# EAGLE schematic main (EAGLE 9.1.3)

## Sheet 1 of 5
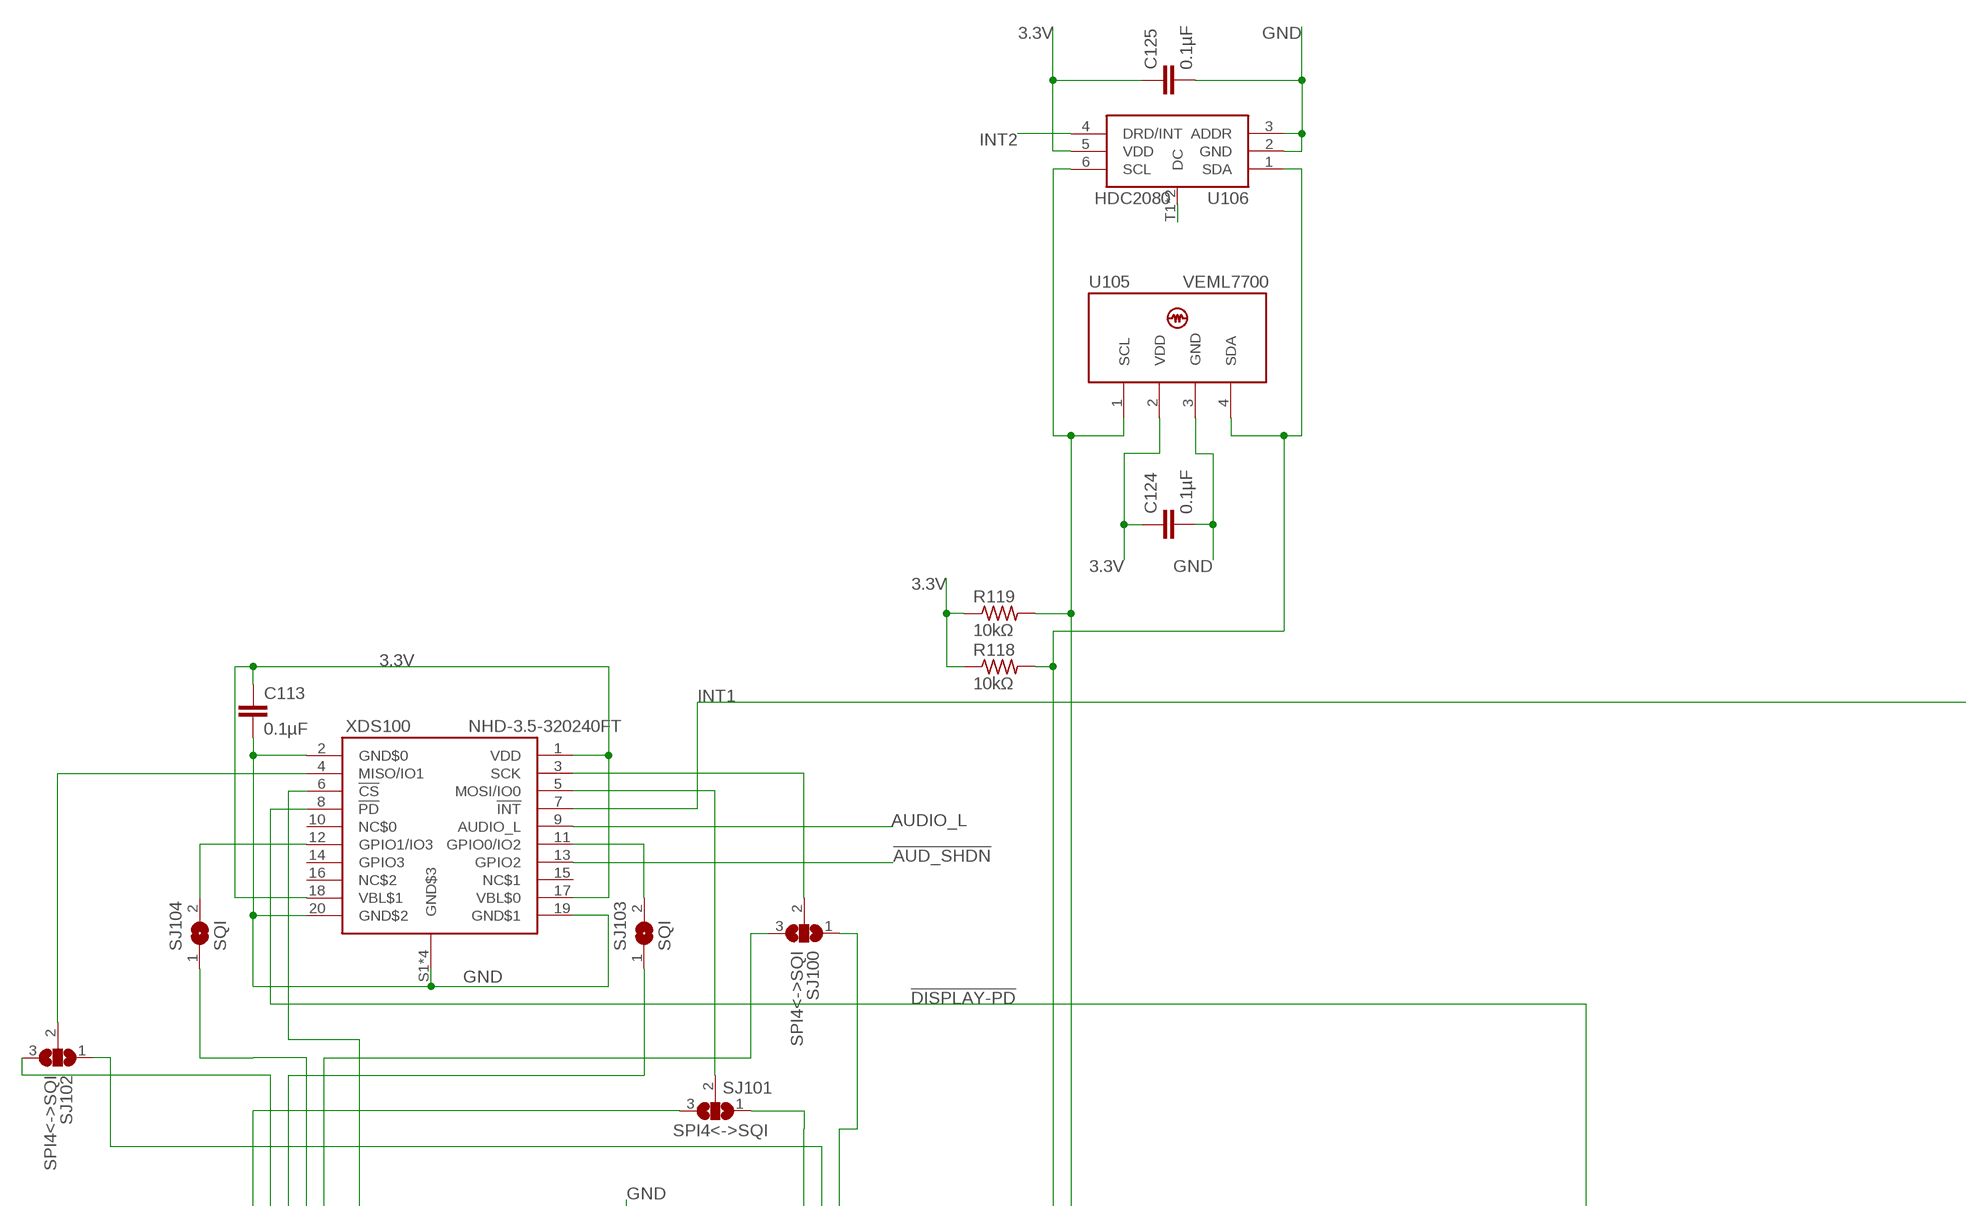
[diagram p0: schematic, sheet 1, part 1 of 3]
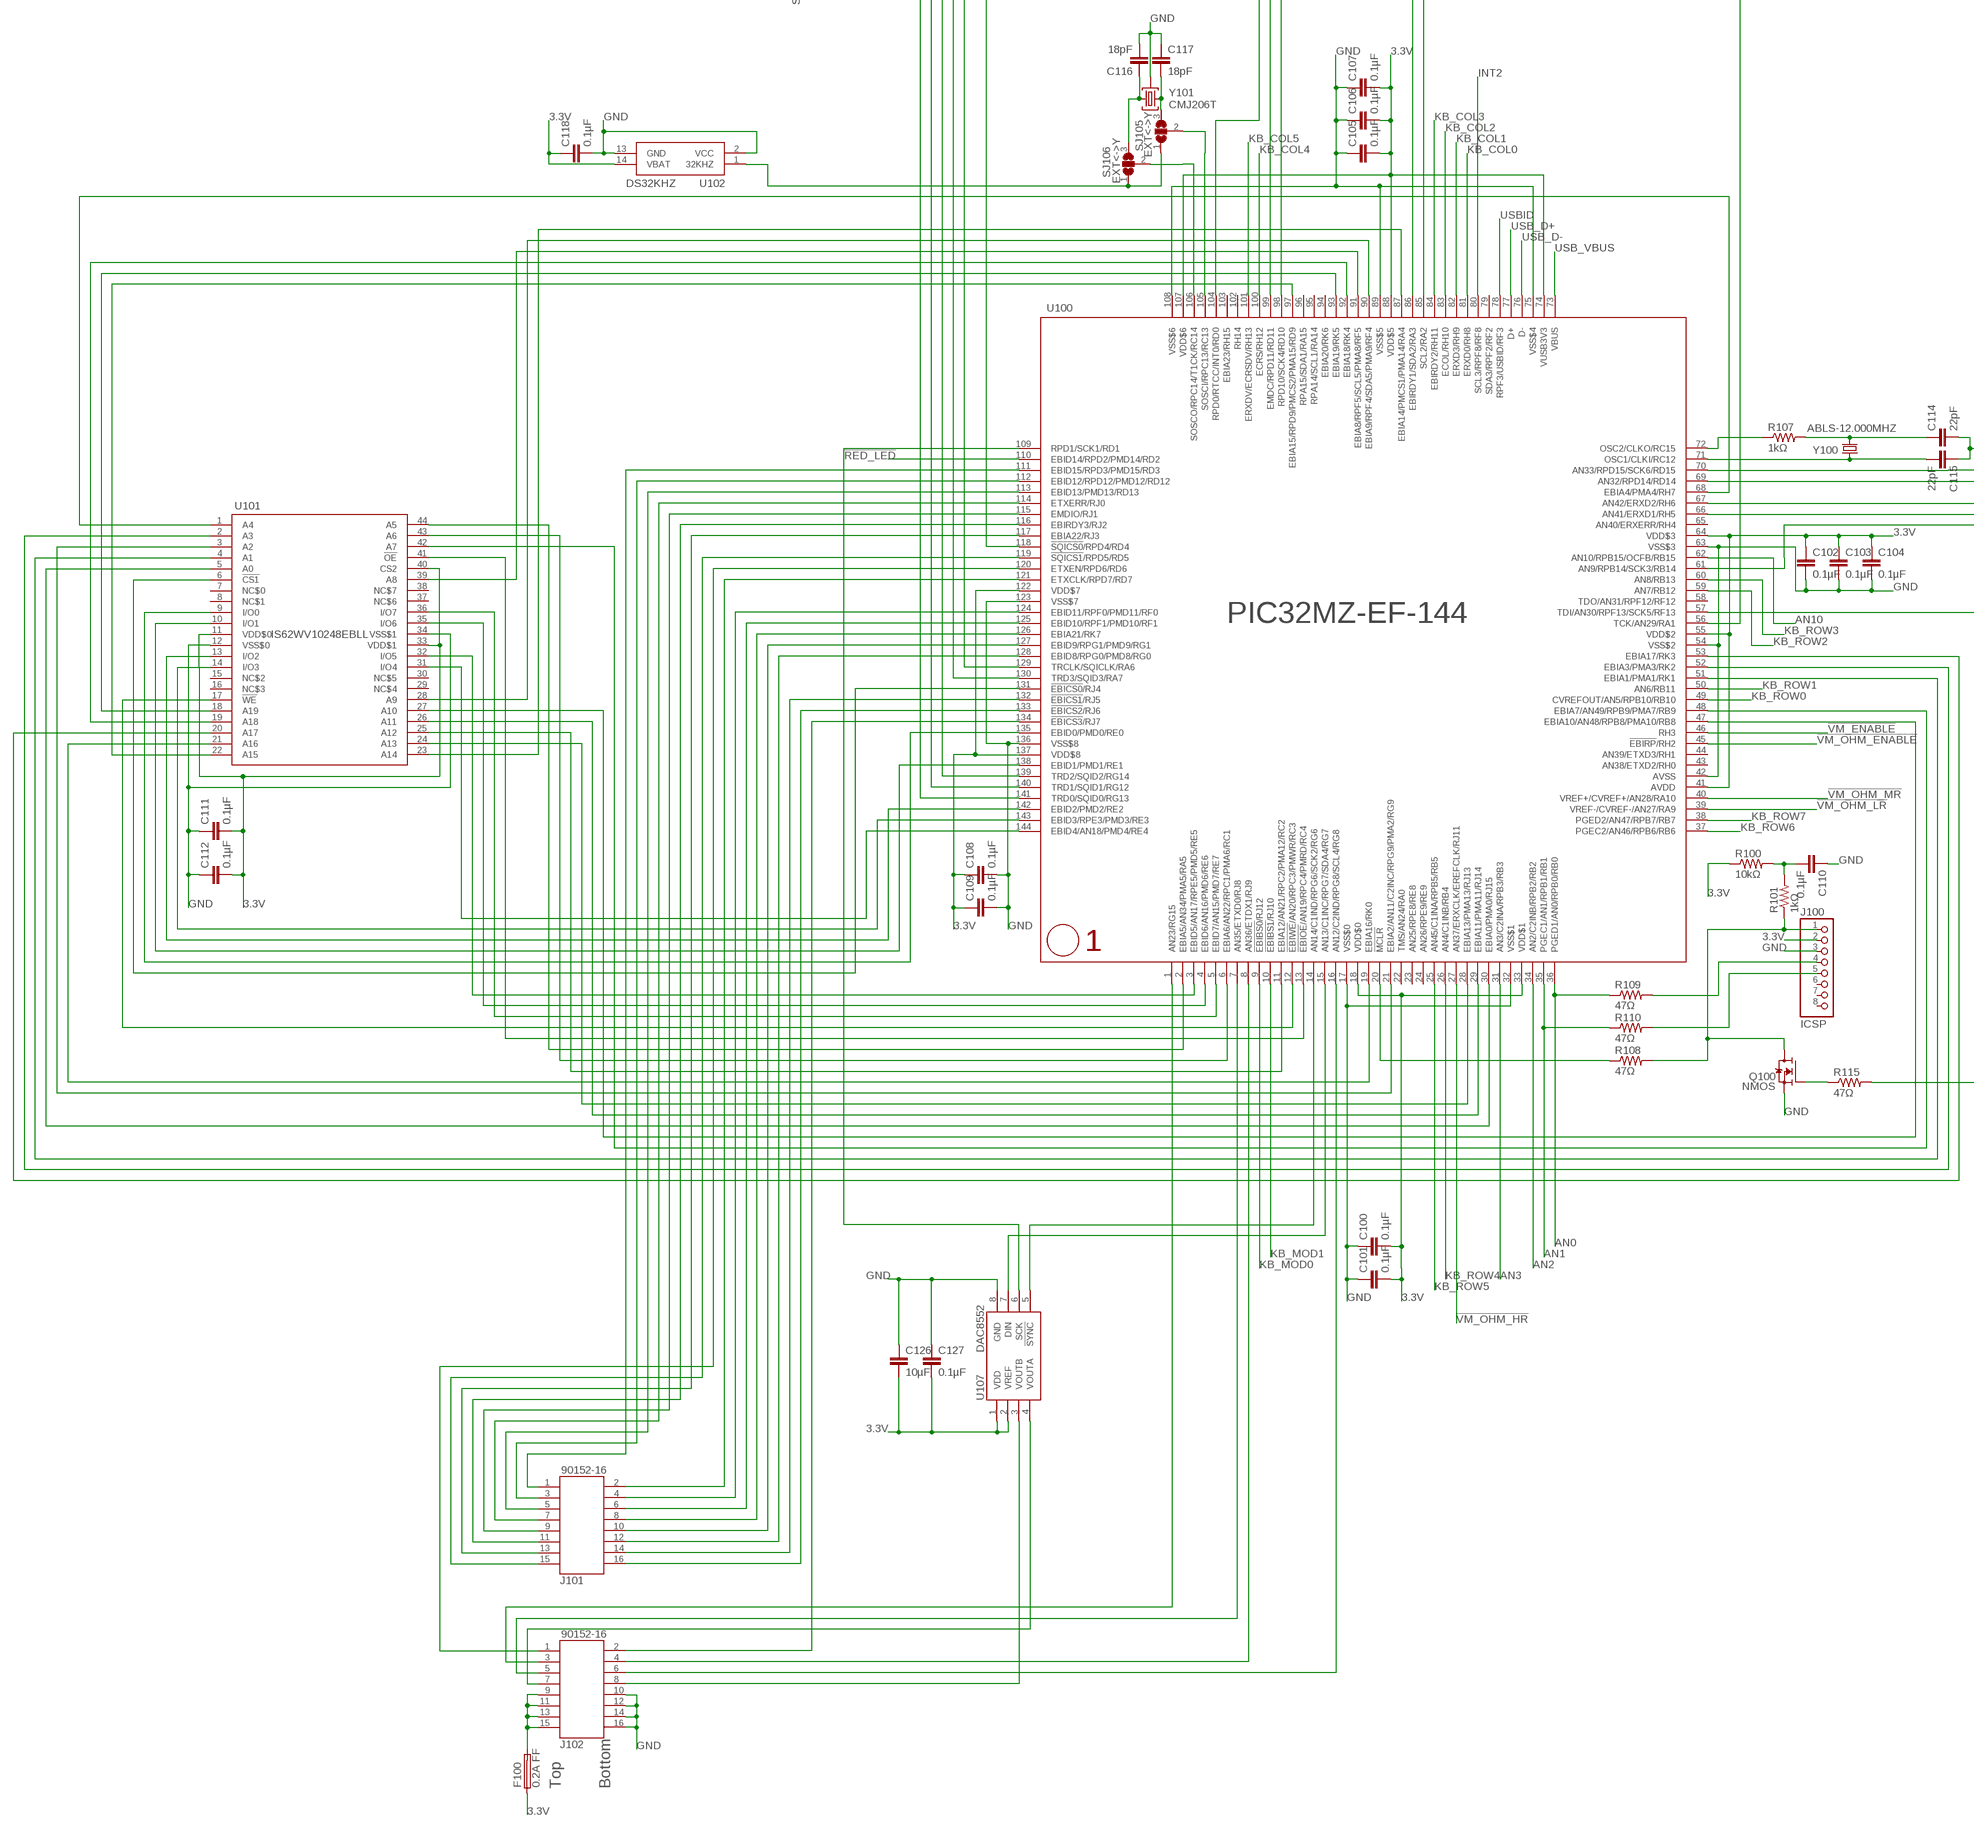
[diagram p1: schematic, sheet 1, part 2 of 3]
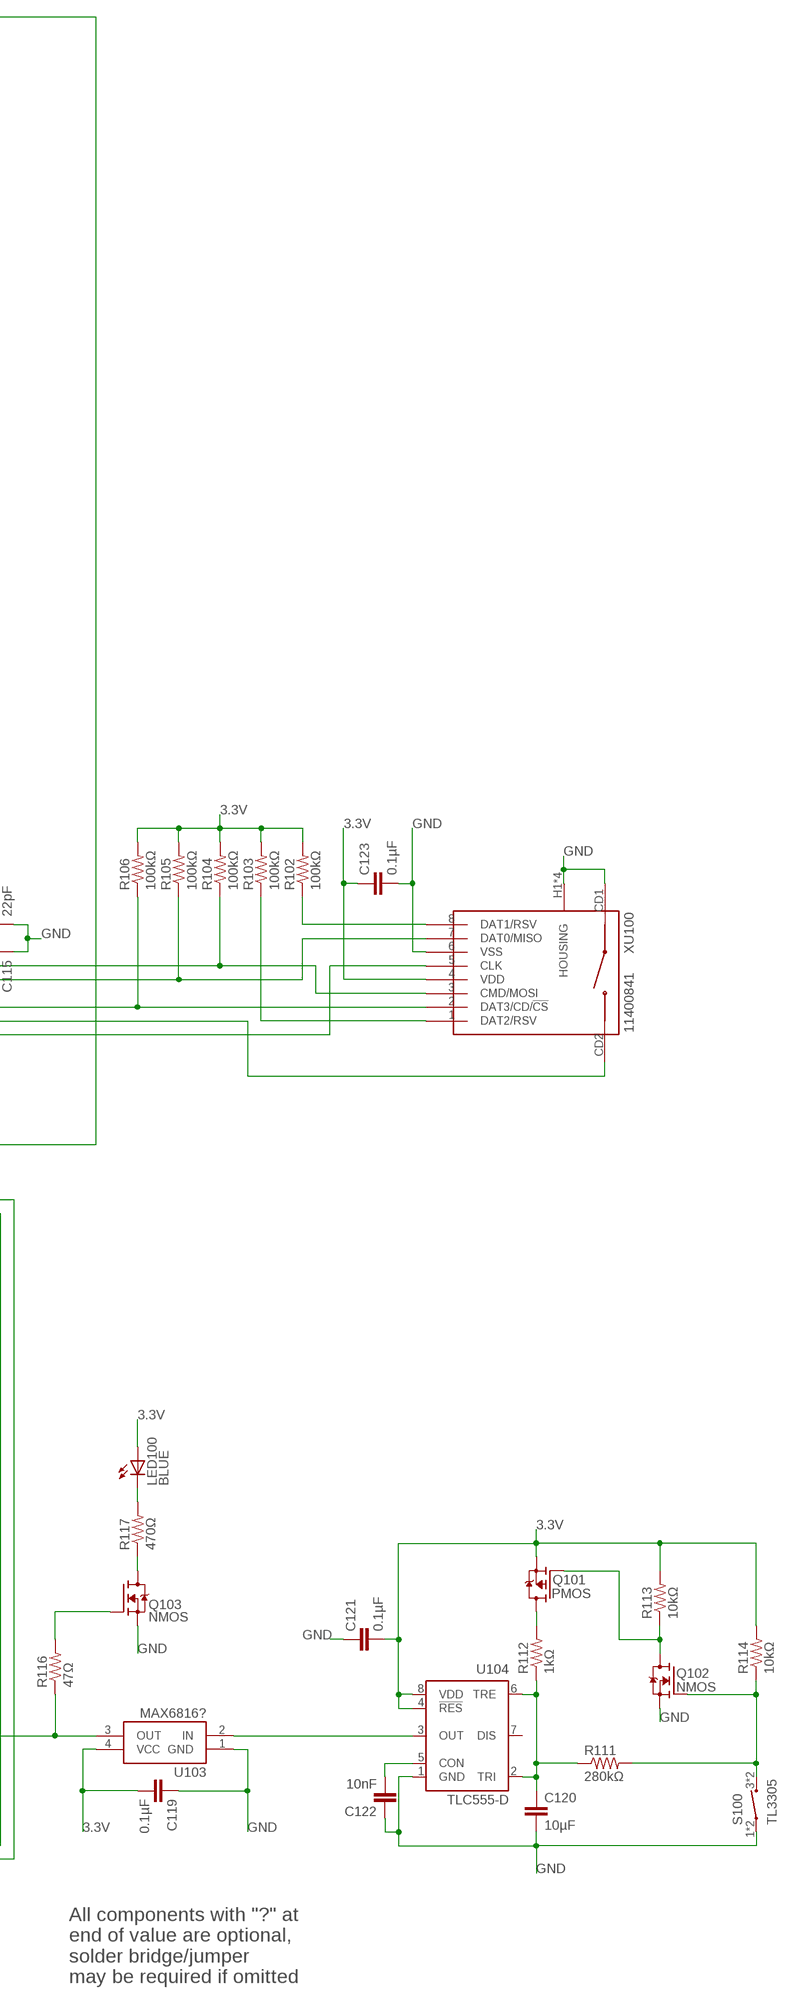
[diagram p2: schematic, sheet 1, part 3 of 3]

### Parts
C100  0.1µF  C-EUC0805K  [C0805K]
C101  0.1µF  C-EUC0805K  [C0805K]
C102  0.1µF  C-EUC0805K  [C0805K]
C103  0.1µF  C-EUC0805K  [C0805K]
C104  0.1µF  C-EUC0805K  [C0805K]
C105  0.1µF  C-EUC0805K  [C0805K]
C106  0.1µF  C-EUC0805K  [C0805K]
C107  0.1µF  C-EUC0805K  [C0805K]
C108  0.1µF  C-EUC0805K  [C0805K]
C109  0.1µF  C-EUC0805K  [C0805K]
C110  0.1µF  C-EUC0805K  [C0805K]
C111  0.1µF  C-EUC0805K  [C0805K]
C112  0.1µF  C-EUC0805K  [C0805K]
C113  0.1µF  C-EUC0805K  [C0805K]
C114  22pF  C-EUC0805K  [C0805K]
C115  22pF  C-EUC0805K  [C0805K]
C116  18pF  C-EUC0805K  [C0805K]
C117  18pF  C-EUC0805K  [C0805K]
C118  0.1µF  C-EUC0805K  [C0805K]
C119  0.1µF  C-EUC0805K  [C0805K]
C120  10µF  C-EUC0805K  [C0805K]
C121  0.1µF  C-EUC0805K  [C0805K]
C122  10nF  C-EUC0805K  [C0805K]
C123  0.1µF  C-EUC0805K  [C0805K]
C124  0.1µF  C-EUC0805K  [C0805K]
C125  0.1µF  C-EUC0805K  [C0805K]
C126  10µF  C-EUC0805K  [C0805K]
C127  0.1µF  C-EUC0805K  [C0805K]
F100  0.2A FF  1206-FUSE  [C1206K]
J100  ICSP  PINHD-1X8  [1X08]
J101  90152-16  [90152-16]
J102  90152-16  [90152-16]
LED100  BLUE  LEDCHIP-LED0805  [CHIP-LED0805]
Q100  NMOS  SOT23-N-MOSFET  [SOT23]
Q101  PMOS  SOT23-P-MOSFET  [SOT23]
Q102  NMOS  SOT23-N-MOSFET  [SOT23]
Q103  NMOS  SOT23-N-MOSFET  [SOT23]
R100  10kΩ  R-US_R0805  [R0805]
R101  1kΩ  R-US_R0805  [R0805]
R102  100kΩ  R-US_R0805  [R0805]
R103  100kΩ  R-US_R0805  [R0805]
R104  100kΩ  R-US_R0805  [R0805]
R105  100kΩ  R-US_R0805  [R0805]
R106  100kΩ  R-US_R0805  [R0805]
R107  1kΩ  R-US_R0805  [R0805]
R108  47Ω  R-US_R0805  [R0805]
R109  47Ω  R-US_R0805  [R0805]
R110  47Ω  R-US_R0805  [R0805]
R111  280kΩ  R-US_R0805  [R0805]
R112  1kΩ  R-US_R0805  [R0805]
R113  10kΩ  R-US_R0805  [R0805]
R114  10kΩ  R-US_R0805  [R0805]
R115  47Ω  R-US_R0805  [R0805]
R116  47Ω  R-US_R0805  [R0805]
R117  470Ω  R-US_R0805  [R0805]
R118  10kΩ  R-US_R0805  [R0805]
R119  10kΩ  R-US_R0805  [R0805]
S100  TL3305  [TL3305_MICROSWITCH]
SJ100  SPI4<->SQI  SJ2W  [SJ_2]
SJ101  SPI4<->SQI  SJ2W  [SJ_2]
SJ102  SPI4<->SQI  SJ2W  [SJ_2]
SJ103  SQI  SJ  [SJ]
SJ104  SQI  SJ  [SJ]
SJ105  EXT<->Y  SJ2W  [SJ_2]
SJ106  EXT<->Y  SJ2W  [SJ_2]
U100  PIC32MZ-EF-144  PIC32MZ-144  [LQFP144-20X20]
U101  IS62WV10248EBLL  [TSOP44]
U102  DS32KHZ  [SO16L]
U103  MAX6816?  MAX6816  [SOT143]
U104  TLC555-D  [SOIC8]
U105  VEML7700  [VEML7700]
U106  HDC2080  [PWSON-6]
U107  DAC8552  [MSOP8]
XDS100  NHD-3.5-320240FT  [NHD_DISPLAY_CONN]
XU100  11400841  [11400841]
Y100  ABLS-12.000MHZ  HC49US-CRYSTAL  [HC49US]
Y101  CMJ206T  [CMJ206T-CUSTOM]

### Nets
3.3V: C100.2 C101.2 C102.1 C103.1 C104.1 C105.2 C106.2 C107.2 C108.1 C109.1 C111.2 C112.2 C113.1 C118.1 C119.2 C121.2 C123.1 C124.1 C125.1 C126.2 C127.2 F100.1 J100.2 LED100.A Q101.2(S) R100.1 R102.2 R103.2 R104.2 R105.2 R106.2 R113.2 R114.2 R118.1 R119.1 U100.18(VDD$0) U100.33(VDD$1) U100.41(AVDD) U100.55(VDD$2) U100.64(VDD$3) U100.74(VUSB3V3) U100.88(VDD$5) U100.107(VDD$6) U100.122(VDD$7) U100.137(VDD$8) U101.11(VDD$0) U101.33(VDD$1) U101.40(CS2) U102.14(VBAT) U103.4(VCC) U104.4(!RES) U104.8(VDD) U105.2(VDD) U106.5(VDD) U107.1(VDD) U107.2(VREF) XDS100.1(VDD) XDS100.17(VBL$0) XDS100.18(VBL$1) XU100.4(VDD) ; also sheet 2,3,4,5
!AUD_SHDN: XDS100.13(GPIO2) ; also sheet 5
!DISPLAY-PD: U100.56(TCK/AN29/RA1) XDS100.8(!PD)
!EBICS0: U100.131(!EBICS0!/RJ4) U101.6(!CS1)
!EBIOE: U100.13(!EBIOE!/AN19/RPC4/PMRD/RC4) U101.41(!OE)
!EBIWE: U100.12(!EBIWE!/AN20/RPC3/PMWR/RC3) U101.17(!WE)
!MCLR: R108.1 U100.20(!MCLR)
!MCLR!_FILTER: C110.2 R100.2 R101.2
!MCLR!_R: J100.1 Q100.3(D) R101.1 R108.2
!RED_LED: U100.110(EBID14/RPD2/PMD14/RD2) ; also sheet 2
!RESET_MAN!_RAW: Q102.1(G) R111.2 R114.1 S100.3 S100.4
!SQICS0: U100.118(!SQICS0!/RPD4/RD4) XDS100.6(!CS)
!VM_ENABLE: U100.46(RH3) ; also sheet 4
!VM_OHM_ENABLE: U100.45(!EBIRP!/RH2) ; also sheet 4
!VM_OHM_HR: U100.27(AN37/ERXCLK/EREFCLK/RJ11) ; also sheet 4
!VM_OHM_LR: U100.39(VREF-/CVREF-/AN27/RA9) ; also sheet 4
!VM_OHM_MR: U100.40(VREF+/CVREF+/AN28/RA10) ; also sheet 4
AN0: R109.1 U100.36(PGED1/AN0/RPB0/RB0) ; also sheet 4
AN1: R110.1 U100.35(PGEC1/AN1/RPB1/RB1) ; also sheet 4
AN2: U100.34(AN2/C2INB/RPB2/RB2) ; also sheet 4
AN3: U100.31(AN3/C2INA/RPB3/RB3) ; also sheet 4
AN10: U100.62(AN10/RPB15/OCFB/RB15) ; also sheet 2
AN12/A3: J102.6 U100.16(AN12/C2IND/RPG8/SCL4/RG8)
AN23/A0: J102.3 U100.1(AN23/RG15)
AN35/A1: J102.5 U100.7(AN35/ETXD0/RJ8)
AN36/A2: J102.4 U100.8(AN36/ETDX1/RJ9)
AUDIO_L: XDS100.9(AUDIO_L) ; also sheet 5
DAC_OUT_A: J102.7 U107.4(VOUTA)
DAC_OUT_B: J102.8 U107.3(VOUTB)
DISP_IO0: SJ101.2 XDS100.5(MOSI/IO0)
DISP_IO1: SJ102.2 XDS100.4(MISO/IO1)
DISP_IO2: SJ103.2 XDS100.11(GPIO0/IO2)
DISP_IO3: SJ104.2 XDS100.12(GPIO1/IO3)
DISP_SCK: SJ100.2 XDS100.3(SCK)
EBIA0: U100.30(EBIA0/PMA0/RJ15) U101.5(A0)
EBIA1: U100.51(EBIA1/PMA1/RK1) U101.4(A1)
EBIA2: U100.21(EBIA2/AN11/C2INC/RPG9/PMA2/RG9) U101.3(A2)
EBIA3: U100.52(EBIA3/PMA3/RK2) U101.2(A3)
EBIA4: U100.68(EBIA4/PMA4/RH7) U101.1(A4)
EBIA5: U100.2(EBIA5/AN34/PMA5/RA5) U101.44(A5)
EBIA6: U100.6(EBIA6/AN22/RPC1/PMA6/RC1) U101.43(A6)
EBIA7: U100.48(EBIA7/AN49/RPB9/PMA7/RB9) U101.42(A7)
EBIA8: U100.91(EBIA8/RPF5/SCL5/PMA8/RF5) U101.39(A8)
EBIA9: U100.90(EBIA9/RPF4/SDA5/PMA9/RF4) U101.28(A9)
EBIA10: U100.47(EBIA10/AN48/RPB8/PMA10/RB8) U101.27(A10)
EBIA11: U100.29(EBIA11/PMA11/RJ14) U101.26(A11)
EBIA12: U100.11(EBIA12/AN21/RPC2/PMA12/RC2) U101.25(A12)
EBIA13: U100.28(EBIA13/PMA13/RJ13) U101.24(A13)
EBIA14: U100.87(EBIA14/PMCS1/PMA14/RA4) U101.23(A14)
EBIA15: U100.97(EBIA15/RPD9/PMCS2/PMA15/RD9) U101.22(A15)
EBIA16: U100.19(EBIA16/RK0) U101.21(A16)
EBIA17: U100.53(EBIA17/RK3) U101.20(A17)
EBIA18: U100.92(EBIA18/RK4) U101.19(A18)
EBIA19: U100.93(EBIA19/RK5) U101.18(A19)
EBID0: U100.135(EBID0/PMD0/RE0) U101.9(I/O0)
EBID1: U100.138(EBID1/PMD1/RE1) U101.10(I/O1)
EBID2: U100.142(EBID2/PMD2/RE2) U101.13(I/O2)
EBID3: U100.143(EBID3/RPE3/PMD3/RE3) U101.14(I/O3)
EBID4: U100.144(EBID4/AN18/PMD4/RE4) U101.31(I/O4)
EBID5: U100.3(EBID5/AN17/RPE5/PMD5/RE5) U101.32(I/O5)
EBID6: U100.4(EBID6/AN16/PMD6/RE6) U101.35(I/O6)
EBID7: U100.5(EBID7/AN15/PMD7/RE7) U101.36(I/O7)
GND: C100.1 C101.1 C102.2 C103.2 C104.2 C105.1 C106.1 C107.1 C108.2 C109.2 C110.1 C111.1 C112.1 C113.2 C114.2 C115.1 C116.2 C117.1 C118.2 C119.1 C120.2 C121.1 C122.1 C123.2 C124.2 C125.2 C126.1 C127.1 J100.3 J102.10 J102.12 J102.14 J102.16 Q100.2(S) Q102.2(S) Q103.2(S) S100.1 S100.2 U100.17(VSS$0) U100.32(VSS$1) U100.42(AVSS) U100.54(VSS$2) U100.63(VSS$3) U100.75(VSS$4) U100.89(VSS$5) U100.108(VSS$6) U100.123(VSS$7) U100.136(VSS$8) U101.12(VSS$0) U101.34(VSS$1) U102.2(VCC) U102.13(GND) U103.1(GND) U104.1(GND) U105.3(GND) U106.2(GND) U106.3(ADDR) U107.8(GND) XDS100.2(GND$0) XDS100.19(GND$1) XDS100.20(GND$2) XDS100.S1(GND$3) XDS100.S2(GND$3) XDS100.S3(GND$3) XDS100.S4(GND$3) XU100.6(VSS) XU100.CD1 XU100.H1(HOUSING) XU100.H2(HOUSING) XU100.H3(HOUSING) XU100.H4(HOUSING) Y101.GND ; also sheet 2,4,5
INT1: U100.57(TDI/AN30/RPF13/SCK5/RF13) XDS100.7(!INT)
INT2: U100.80(SCL3/RPF8/RF8) U106.4(DRD/INT)
KB_COL0: U100.81(ERXD0/RH8) ; also sheet 3
KB_COL1: U100.82(ERXD3/RH9) ; also sheet 3
KB_COL2: U100.83(ECOL/RH10) ; also sheet 3
KB_COL3: U100.84(EBIRDY2/RH11) ; also sheet 3
KB_COL4: U100.100(ECRS/RH12) ; also sheet 3
KB_COL5: U100.101(ERXDV/ECRSDV/RH13) ; also sheet 3
KB_MOD0: U100.9(!EBIBS0!/RJ12) ; also sheet 3
KB_MOD1: U100.10(!EBIBS1!/RJ10) ; also sheet 3
KB_ROW0: U100.49(CVREFOUT/AN5/RPB10/RB10) ; also sheet 3
KB_ROW1: U100.50(AN6/RB11) ; also sheet 3
KB_ROW2: U100.59(AN7/RB12) ; also sheet 3
KB_ROW3: U100.60(AN8/RB13) ; also sheet 3
KB_ROW4: U100.26(AN4/C1INB/RB4) ; also sheet 3
KB_ROW5: U100.25(AN45/C1INA/RPB5/RB5) ; also sheet 3
KB_ROW6: U100.37(PGEC2/AN46/RPB6/RB6) ; also sheet 3
KB_ROW7: U100.38(PGED2/AN47/RPB7/RB7) ; also sheet 3
LED100_K: LED100.C R117.2
LED100_SWITCHED: Q103.3(D) R117.1
OSC1: C115.2 U100.71(OSC1/CLKI/RC12) Y100.1
OSC2: R107.1 U100.72(OSC2/CLKO/RC15)
OSC2_R: C114.1 R107.2 Y100.2
OUT_3.3V: F100.2 J102.9 J102.11 J102.13 J102.15
PGEC_R: J100.5 R110.2
PGED_R: J100.4 R109.2
RD3/D0: J101.1 U100.111(EBID15/RPD3/PMD15/RD3)
RD5/D7: J101.15 U100.119(!SQICS1!/RPD5/RD5)
RD6/D8: J102.1 U100.120(ETXEN/RPD6/RD6)
RD7/D9: J101.2 U100.121(ETXCLK/RPD7/RD7)
RD12/D1: J101.3 U100.112(EBID12/RPD12/PMD12/RD12)
RD13/D2: J101.5 U100.113(EBID13/PMD13/RD13)
RESET_MAN_CAP: C120.1 R111.1 R112.1 U104.2(TRI) U104.6(TRE)
RESET_MAN_CHG: Q101.3(D) R112.2
RESET_MAN_CON: C122.2 U104.5(CON)
RESET_MAN_FINAL: R115.2 R116.1 U103.3(OUT)
RESET_MAN_GATE: Q100.1(G) R115.1
RESET_MAN_LED_GATE: Q103.1(G) R116.2
RESET_MAN_RAW: Q101.1(G) Q102.3(D) R113.1
RESET_MAN_TIMED: U103.2(IN) U104.3(OUT)
RF0/D10: J101.4 U100.124(EBID11/RPF0/PMD11/RF0)
RF1/D11: J101.6 U100.125(EBID10/RPF1/PMD10/RF1)
RG0/D14: J101.12 U100.128(EBID8/RPG0/PMD8/RG0)
RG1/D13: J101.10 U100.127(EBID9/RPG1/PMD9/RG1)
RJ0/D3: J101.7 U100.114(ETXERR/RJ0)
RJ1/D4: J101.9 U100.115(EMDIO/RJ1)
RJ2/D5: J101.11 U100.116(EBIRDY3/RJ2)
RJ3/D6: J101.13 U100.117(EBIA22/RJ3)
RJ5/D15: J101.14 U100.132(!EBICS1!/RJ5)
RJ6/D16: J101.16 U100.133(!EBICS2!/RJ6)
RJ7/D17: J102.2 U100.134(!EBICS3!/RJ7)
RK7/D12: J101.8 U100.126(EBIA21/RK7)
SCK1: U100.109(RPD1/SCK1/RD1) U107.6(SCK)
SCK3: U100.61(AN9/RPB14/SCK3/RB14) XU100.5(CLK)
SCK4: SJ100.1 U100.98(RPD10/SCK4/RD10)
SCL2: R119.2 U100.85(SCL2/RA2) U105.1(SCL) U106.6(SCL)
SD_CS: R106.1 U100.67(AN42/ERXD2/RH6) XU100.2(DAT3/CD/!CS)
SD_DETECT: U100.66(AN41/ERXD1/RH5) XU100.CD2
SD_RSV1: R102.1 XU100.8(DAT1/RSV)
SD_RSV2: R103.1 XU100.1(DAT2/RSV)
SDA2: R118.2 U100.86(EBIRDY1/SDA2/RA3) U105.4(SDA) U106.1(SDA)
SDI3: R105.1 U100.69(AN32/RPD14/RD14) XU100.7(DAT0/MISO)
SDI4: SJ102.1 U100.99(EMDC/RPD11/RD11)
SDO1: U100.15(AN13/C1INC/RPG7/SDA4/RG7) U107.7(DIN)
SDO3: R104.1 U100.70(AN33/RPD15/SCK6/RD15) XU100.3(CMD/MOSI)
SDO4: SJ101.1 U100.104(RPD0/RTCC/INT0/RD0)
SOSC_1: C117.2 SJ105.3 Y101.2
SOSC_2: C116.1 SJ106.3 Y101.1
SOSC_EXT: SJ105.1 SJ106.1 U102.1(32KHZ)
SOSCI: SJ105.2 U100.105(SOSCI/RPC13/RC13)
SOSCO: SJ106.2 U100.106(SOSCO/RPC14/T1CK/RC14)
SQICLK: SJ100.3 U100.129(TRCLK/SQICLK/RA6)
SQID0: SJ101.3 U100.141(TRD0/SQID0/RG13)
SQID1: SJ102.3 U100.140(TRD1/SQID1/RG12)
SQID2: SJ103.1 U100.139(TRD2/SQID2/RG14)
SQID3: SJ104.1 U100.130(TRD3/SQID3/RA7)
SS1: U100.14(AN14/C1IND/RPG6/SCK2/RG6) U107.5(!SYNC)
U106_TP: U106.T1(DC) U106.T2(DC)
USB_D+ [usb_diffpair]: U100.77(D+) ; also sheet 2
USB_D- [usb_diffpair]: U100.76(D-) ; also sheet 2
USB_VBUS: U100.73(VBUS) ; also sheet 2
USBID: U100.78(RPF3/USBID/RF3) ; also sheet 2
Unconnected: J100.6 J100.7 J100.8 U100.22(TMS/AN24/RA0) U100.23(AN25/RPE8/RE8) U100.24(AN26/RPE9/RE9) U100.43(AN38/ETXD2/RH0) U100.44(AN39/ETXD3/RH1) U100.58(TDO/AN31/RPF12/RF12) U100.65(AN40/ERXERR/RH4) U100.79(SDA3/RPF2/RF2) U100.94(EBIA20/RK6) U100.95(RPA14/SCL1/RA14) U100.96(RPA15/SDA1/RA15) U100.102(RH14) U100.103(EBIA23/RH15) U101.7(NC$0) U101.8(NC$1) U101.15(NC$2) U101.16(NC$3) U101.29(NC$4) U101.30(NC$5) U101.37(NC$6) U101.38(NC$7) U104.7(DIS) XDS100.10(NC$0) XDS100.14(GPIO3) XDS100.15(NC$1) XDS100.16(NC$2)

### Notes on the sheet
- All components with "?" at
  end of value are optional,
  solder bridge/jumper
  may be required if omitted
- Top
  
  
  Bottom

## Sheet 2 of 5
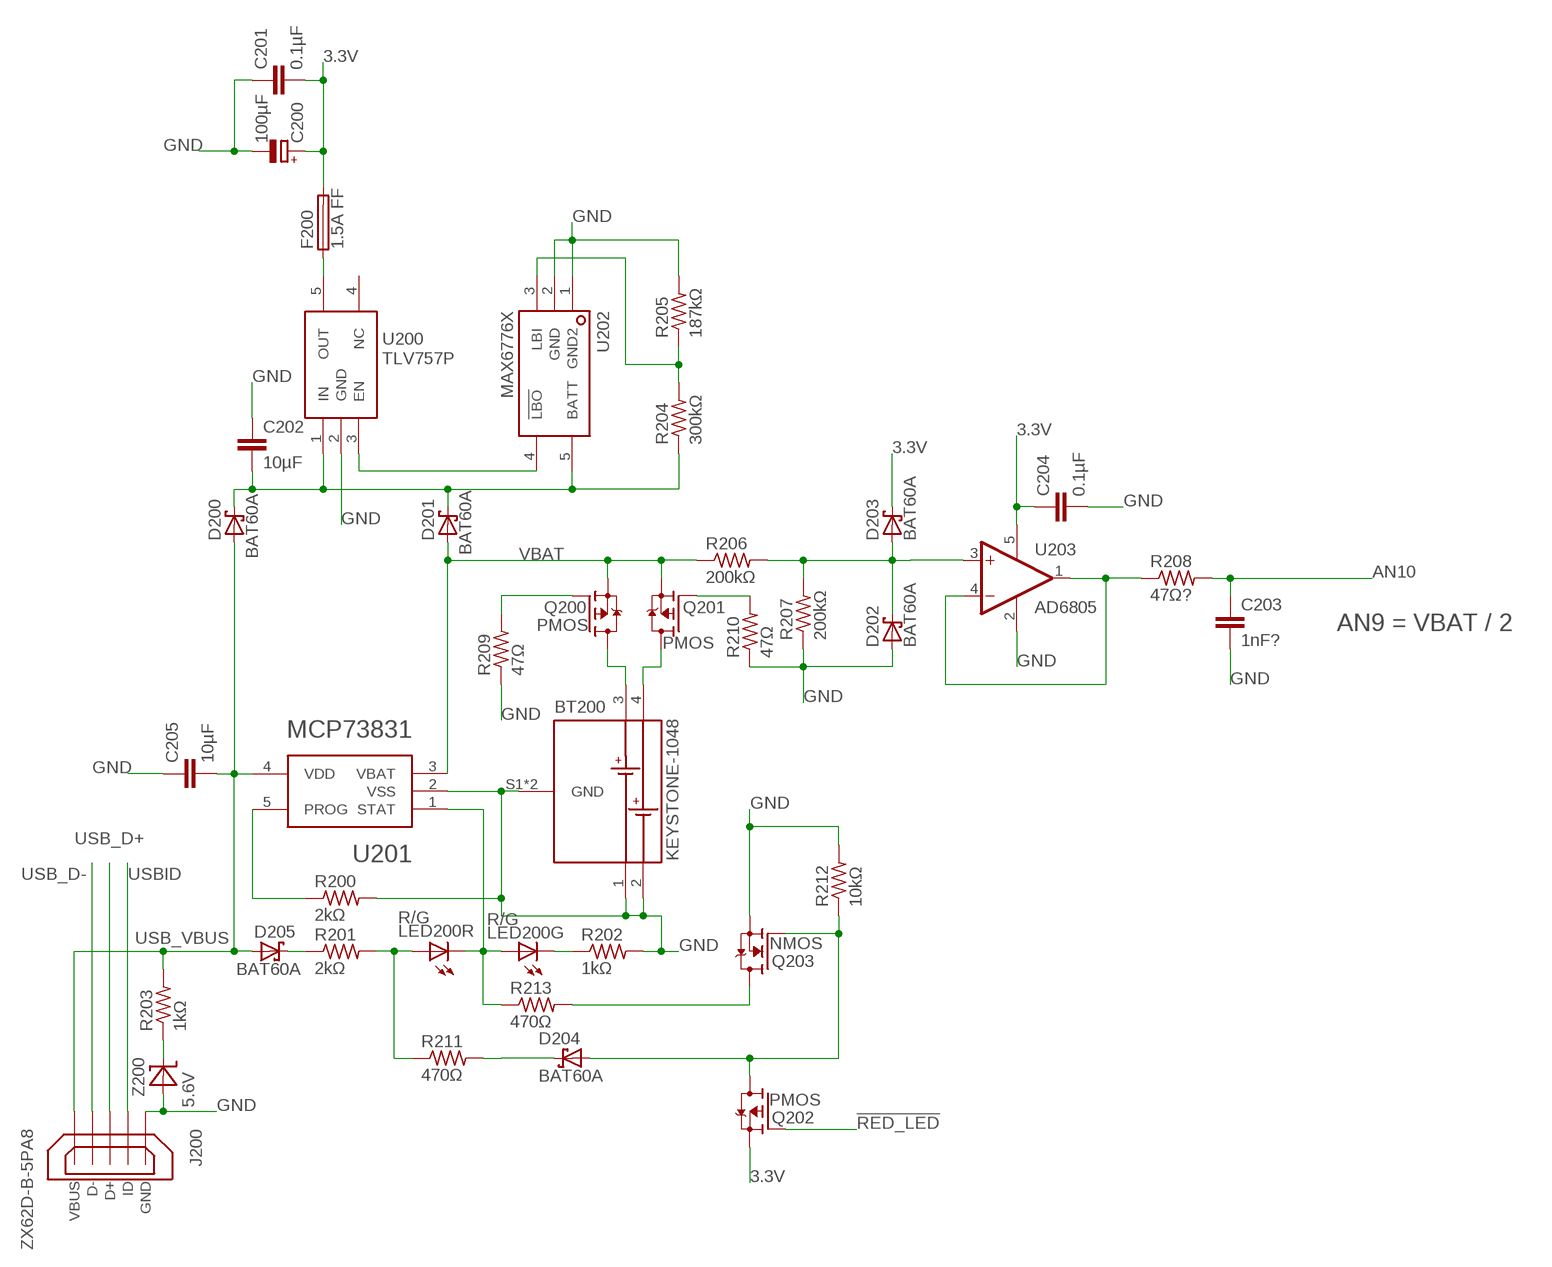
[diagram p3: schematic, sheet 2]

### Parts
BT200  KEYSTONE-1048  [KEYSTONE-1048]
C200  100µF  CPOL_1206  [C1206K-POL]
C201  0.1µF  C-EUC0805K  [C0805K]
C202  10µF  C-EUC0805K  [C0805K]
C203  1nF?  C-EUC0805K  [C0805K]
C204  0.1µF  C-EUC0805K  [C0805K]
C205  10µF  C-EUC0805K  [C0805K]
D200  BAT60A  SOD323-SCHOTTKY  [SOD323]
D201  BAT60A  SOD323-SCHOTTKY  [SOD323]
D202  BAT60A  SOD323-SCHOTTKY  [SOD323]
D203  BAT60A  SOD323-SCHOTTKY  [SOD323]
D204  BAT60A  SOD323-SCHOTTKY  [SOD323]
D205  BAT60A  SOD323-SCHOTTKY  [SOD323]
F200  1.5A FF  0805-FUSE  [C0805K]
J200  ZX62D-B-5PA8  [ZX62D-B-5PA8]
LED200  R/G  APHBM2012LSURKZGKC  [0805-DUALLED]
Q200  PMOS  SOT23-P-MOSFET  [SOT23]
Q201  PMOS  SOT23-P-MOSFET  [SOT23]
Q202  PMOS  SOT23-P-MOSFET  [SOT23]
Q203  NMOS  SOT23-N-MOSFET  [SOT23]
R200  2kΩ  R-US_R0805  [R0805]
R201  2kΩ  R-US_R0805  [R0805]
R202  1kΩ  R-US_R0805  [R0805]
R203  1kΩ  R-US_R0805  [R0805]
R204  300kΩ  R-US_R0805  [R0805]
R205  187kΩ  R-US_R0805  [R0805]
R206  200kΩ  R-US_R0805  [R0805]
R207  200kΩ  R-US_R0805  [R0805]
R208  47Ω?  R-US_R0805  [R0805]
R209  47Ω  R-US_R0805  [R0805]
R210  47Ω  R-US_R0805  [R0805]
R211  470Ω  R-US_R0805  [R0805]
R212  10kΩ  R-US_R0805  [R0805]
R213  470Ω  R-US_R0805  [R0805]
U200  TLV757P  [SOT23-5L]
U201  MCP73831  [SOT23-5L]
U202  MAX6776X  [SC70-5]
U203  AD6805  [SOT23-5L]
Z200  5.6V  SOD323HE-ZENER  [SOD323HE]

### Nets
3.3V: C200.1(+) C201.2 C204.1 D203.1(C) F200.2 Q202.2(S) U203.5(V+) ; also sheet 1,3,4,5
!RED_LED: Q202.1(G) ; also sheet 1
AN10: C203.1 R208.2 ; also sheet 1
BAT1_PMOS_GATE: Q200.1(G) R209.2
BAT2_PMOS_GATE: Q201.1(G) R210.2
BATM_LBI: R204.2 R205.1 U202.3(LBI)
CHG_PROG: R200.1 U201.5(PROG)
CHG_STAT: LED200.A2(G:A) LED200.K1(R:C) R213.1 U201.1(STAT)
GND: BT200.1(BAT1-) BT200.2(BAT2-) BT200.S1(GND) BT200.S2(GND) C200.2(-) C201.1 C202.1 C203.2 C204.2 C205.1 D202.2(A) J200.5(GND) J200.S1(GND) J200.S2(GND) J200.S3(GND) J200.S4(GND) Q203.2(S) R200.2 R202.2 R205.2 R207.1 R209.1 R210.1 R212.2 U200.2(GND) U201.2(VSS) U202.1(GND2) U202.2(GND) U203.2(V-) Z200.2(A) ; also sheet 1,4,5
LED200_GK: LED200.K2(G:C) R202.1
LED200_RA: LED200.A1(R:A) R201.2 R211.1
LED200_RA_EXT: D204.1(C) R211.2
LED200_RA_INT: D205.1(C) R201.1
LED200_RK_EXT: Q203.3(D) R213.2
RED_LED: D204.2(A) Q202.3(D) Q203.1(G) R212.1
USB_D+ [usb_diffpair]: J200.3(D+) ; also sheet 1
USB_D- [usb_diffpair]: J200.2(D-) ; also sheet 1
USB_VBUS: C205.2 D200.2(A) D205.2(A) J200.1(VBUS) R203.2 U201.4(VDD) ; also sheet 1
USBID: J200.4(ID) ; also sheet 1
VBAT: D201.2(A) Q200.2(S) Q201.2(S) R206.1 U201.3(VBAT)
VBAT1: BT200.3(BAT1+) Q200.3(D)
VBAT2: BT200.4(BAT2+) Q201.3(D)
VBAT_SENSE: D202.1(C) D203.2(A) R206.2 R207.2 U203.3(+IN)
VBAT_SENSE_BUF: R208.1 U203.1(OUT) U203.4(-IN)
VREG_EN: U200.3(EN) U202.4(!LBO)
VREG_IN: C202.2 D200.1(C) D201.1(C) R204.1 U200.1(IN) U202.5(BATT)
VREG_OUT: F200.1 U200.5(OUT)
Z200_K: R203.1 Z200.1(C)
Unconnected: U200.4(NC)

### Notes on the sheet
- AN9 = VBAT / 2

## Sheet 3 of 5
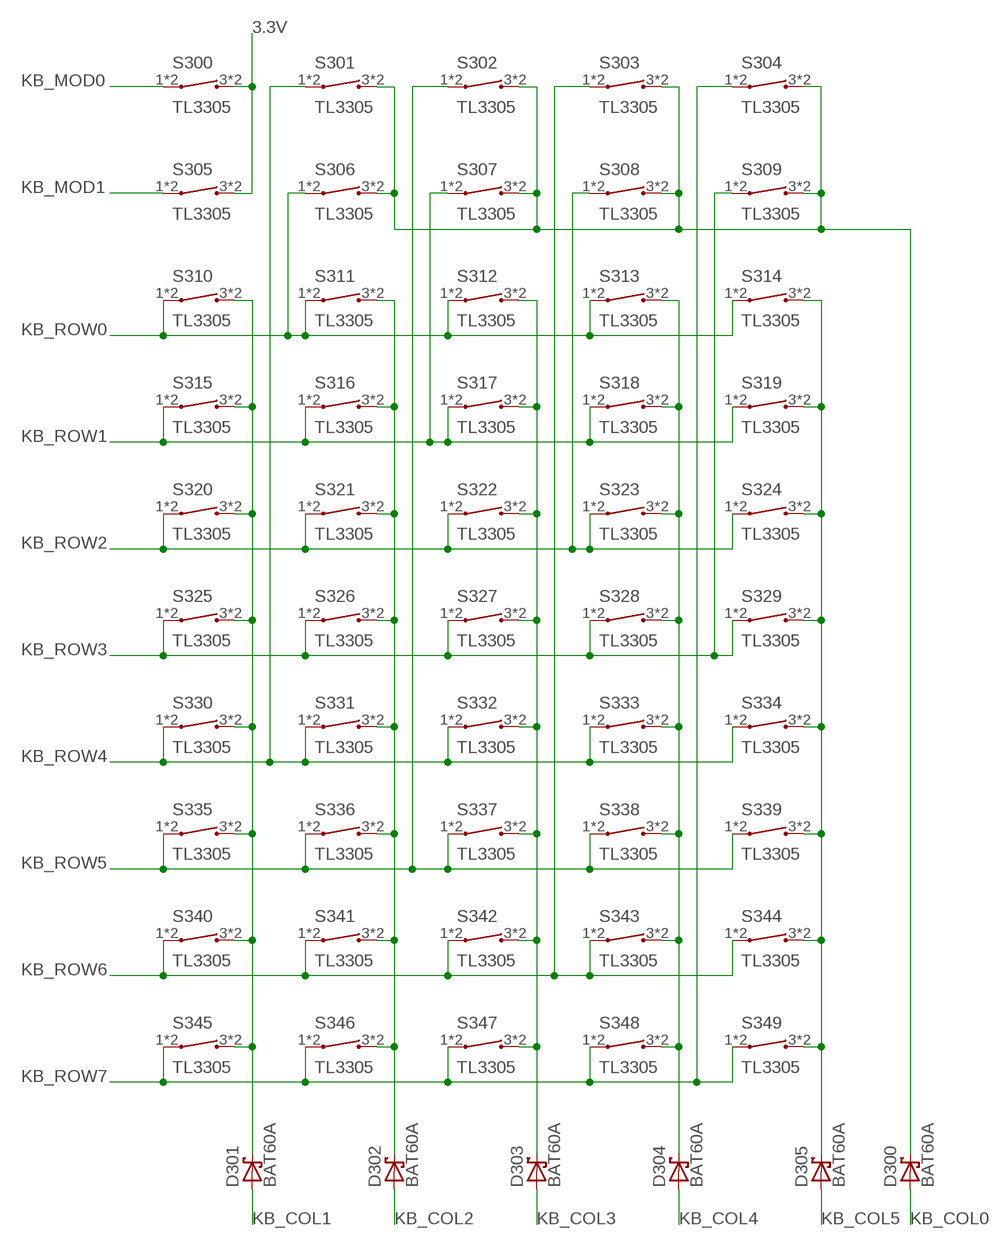
[diagram p4: schematic, sheet 3]

### Parts
D300  BAT60A  SOD323-SCHOTTKY  [SOD323]
D301  BAT60A  SOD323-SCHOTTKY  [SOD323]
D302  BAT60A  SOD323-SCHOTTKY  [SOD323]
D303  BAT60A  SOD323-SCHOTTKY  [SOD323]
D304  BAT60A  SOD323-SCHOTTKY  [SOD323]
D305  BAT60A  SOD323-SCHOTTKY  [SOD323]
S300  TL3305  [TL3305_MICROSWITCH]
S301  TL3305  [TL3305_MICROSWITCH]
S302  TL3305  [TL3305_MICROSWITCH]
S303  TL3305  [TL3305_MICROSWITCH]
S304  TL3305  [TL3305_MICROSWITCH]
S305  TL3305  [TL3305_MICROSWITCH]
S306  TL3305  [TL3305_MICROSWITCH]
S307  TL3305  [TL3305_MICROSWITCH]
S308  TL3305  [TL3305_MICROSWITCH]
S309  TL3305  [TL3305_MICROSWITCH]
S310  TL3305  [TL3305_MICROSWITCH]
S311  TL3305  [TL3305_MICROSWITCH]
S312  TL3305  [TL3305_MICROSWITCH]
S313  TL3305  [TL3305_MICROSWITCH]
S314  TL3305  [TL3305_MICROSWITCH]
S315  TL3305  [TL3305_MICROSWITCH]
S316  TL3305  [TL3305_MICROSWITCH]
S317  TL3305  [TL3305_MICROSWITCH]
S318  TL3305  [TL3305_MICROSWITCH]
S319  TL3305  [TL3305_MICROSWITCH]
S320  TL3305  [TL3305_MICROSWITCH]
S321  TL3305  [TL3305_MICROSWITCH]
S322  TL3305  [TL3305_MICROSWITCH]
S323  TL3305  [TL3305_MICROSWITCH]
S324  TL3305  [TL3305_MICROSWITCH]
S325  TL3305  [TL3305_MICROSWITCH]
S326  TL3305  [TL3305_MICROSWITCH]
S327  TL3305  [TL3305_MICROSWITCH]
S328  TL3305  [TL3305_MICROSWITCH]
S329  TL3305  [TL3305_MICROSWITCH]
S330  TL3305  [TL3305_MICROSWITCH]
S331  TL3305  [TL3305_MICROSWITCH]
S332  TL3305  [TL3305_MICROSWITCH]
S333  TL3305  [TL3305_MICROSWITCH]
S334  TL3305  [TL3305_MICROSWITCH]
S335  TL3305  [TL3305_MICROSWITCH]
S336  TL3305  [TL3305_MICROSWITCH]
S337  TL3305  [TL3305_MICROSWITCH]
S338  TL3305  [TL3305_MICROSWITCH]
S339  TL3305  [TL3305_MICROSWITCH]
S340  TL3305  [TL3305_MICROSWITCH]
S341  TL3305  [TL3305_MICROSWITCH]
S342  TL3305  [TL3305_MICROSWITCH]
S343  TL3305  [TL3305_MICROSWITCH]
S344  TL3305  [TL3305_MICROSWITCH]
S345  TL3305  [TL3305_MICROSWITCH]
S346  TL3305  [TL3305_MICROSWITCH]
S347  TL3305  [TL3305_MICROSWITCH]
S348  TL3305  [TL3305_MICROSWITCH]
S349  TL3305  [TL3305_MICROSWITCH]

### Nets
3.3V: S300.3 S300.4 S305.3 S305.4 ; also sheet 1,2,4,5
KB_COL0: D300.2(A) ; also sheet 1
KB_COL0_F: D300.1(C) S301.3 S301.4 S302.3 S302.4 S303.3 S303.4 S304.3 S304.4 S306.3 S306.4 S307.3 S307.4 S308.3 S308.4 S309.3 S309.4
KB_COL1: D301.2(A) ; also sheet 1
KB_COL1_F: D301.1(C) S310.3 S310.4 S315.3 S315.4 S320.3 S320.4 S325.3 S325.4 S330.3 S330.4 S335.3 S335.4 S340.3 S340.4 S345.3 S345.4
KB_COL2: D302.2(A) ; also sheet 1
KB_COL2_F: D302.1(C) S311.3 S311.4 S316.3 S316.4 S321.3 S321.4 S326.3 S326.4 S331.3 S331.4 S336.3 S336.4 S341.3 S341.4 S346.3 S346.4
KB_COL3: D303.2(A) ; also sheet 1
KB_COL3_F: D303.1(C) S312.3 S312.4 S317.3 S317.4 S322.3 S322.4 S327.3 S327.4 S332.3 S332.4 S337.3 S337.4 S342.3 S342.4 S347.3 S347.4
KB_COL4: D304.2(A) ; also sheet 1
KB_COL4_F: D304.1(C) S313.3 S313.4 S318.3 S318.4 S323.3 S323.4 S328.3 S328.4 S333.3 S333.4 S338.3 S338.4 S343.3 S343.4 S348.3 S348.4
KB_COL5: D305.2(A) ; also sheet 1
KB_COL5_F: D305.1(C) S314.3 S314.4 S319.3 S319.4 S324.3 S324.4 S329.3 S329.4 S334.3 S334.4 S339.3 S339.4 S344.3 S344.4 S349.3 S349.4
KB_MOD0: S300.1 S300.2 ; also sheet 1
KB_MOD1: S305.1 S305.2 ; also sheet 1
KB_ROW0: S306.1 S306.2 S310.1 S310.2 S311.1 S311.2 S312.1 S312.2 S313.1 S313.2 S314.1 S314.2 ; also sheet 1
KB_ROW1: S307.1 S307.2 S315.1 S315.2 S316.1 S316.2 S317.1 S317.2 S318.1 S318.2 S319.1 S319.2 ; also sheet 1
KB_ROW2: S308.1 S308.2 S320.1 S320.2 S321.1 S321.2 S322.1 S322.2 S323.1 S323.2 S324.1 S324.2 ; also sheet 1
KB_ROW3: S309.1 S309.2 S325.1 S325.2 S326.1 S326.2 S327.1 S327.2 S328.1 S328.2 S329.1 S329.2 ; also sheet 1
KB_ROW4: S301.1 S301.2 S330.1 S330.2 S331.1 S331.2 S332.1 S332.2 S333.1 S333.2 S334.1 S334.2 ; also sheet 1
KB_ROW5: S302.1 S302.2 S335.1 S335.2 S336.1 S336.2 S337.1 S337.2 S338.1 S338.2 S339.1 S339.2 ; also sheet 1
KB_ROW6: S303.1 S303.2 S340.1 S340.2 S341.1 S341.2 S342.1 S342.2 S343.1 S343.2 S344.1 S344.2 ; also sheet 1
KB_ROW7: S304.1 S304.2 S345.1 S345.2 S346.1 S346.2 S347.1 S347.2 S348.1 S348.2 S349.1 S349.2 ; also sheet 1

## Sheet 4 of 5
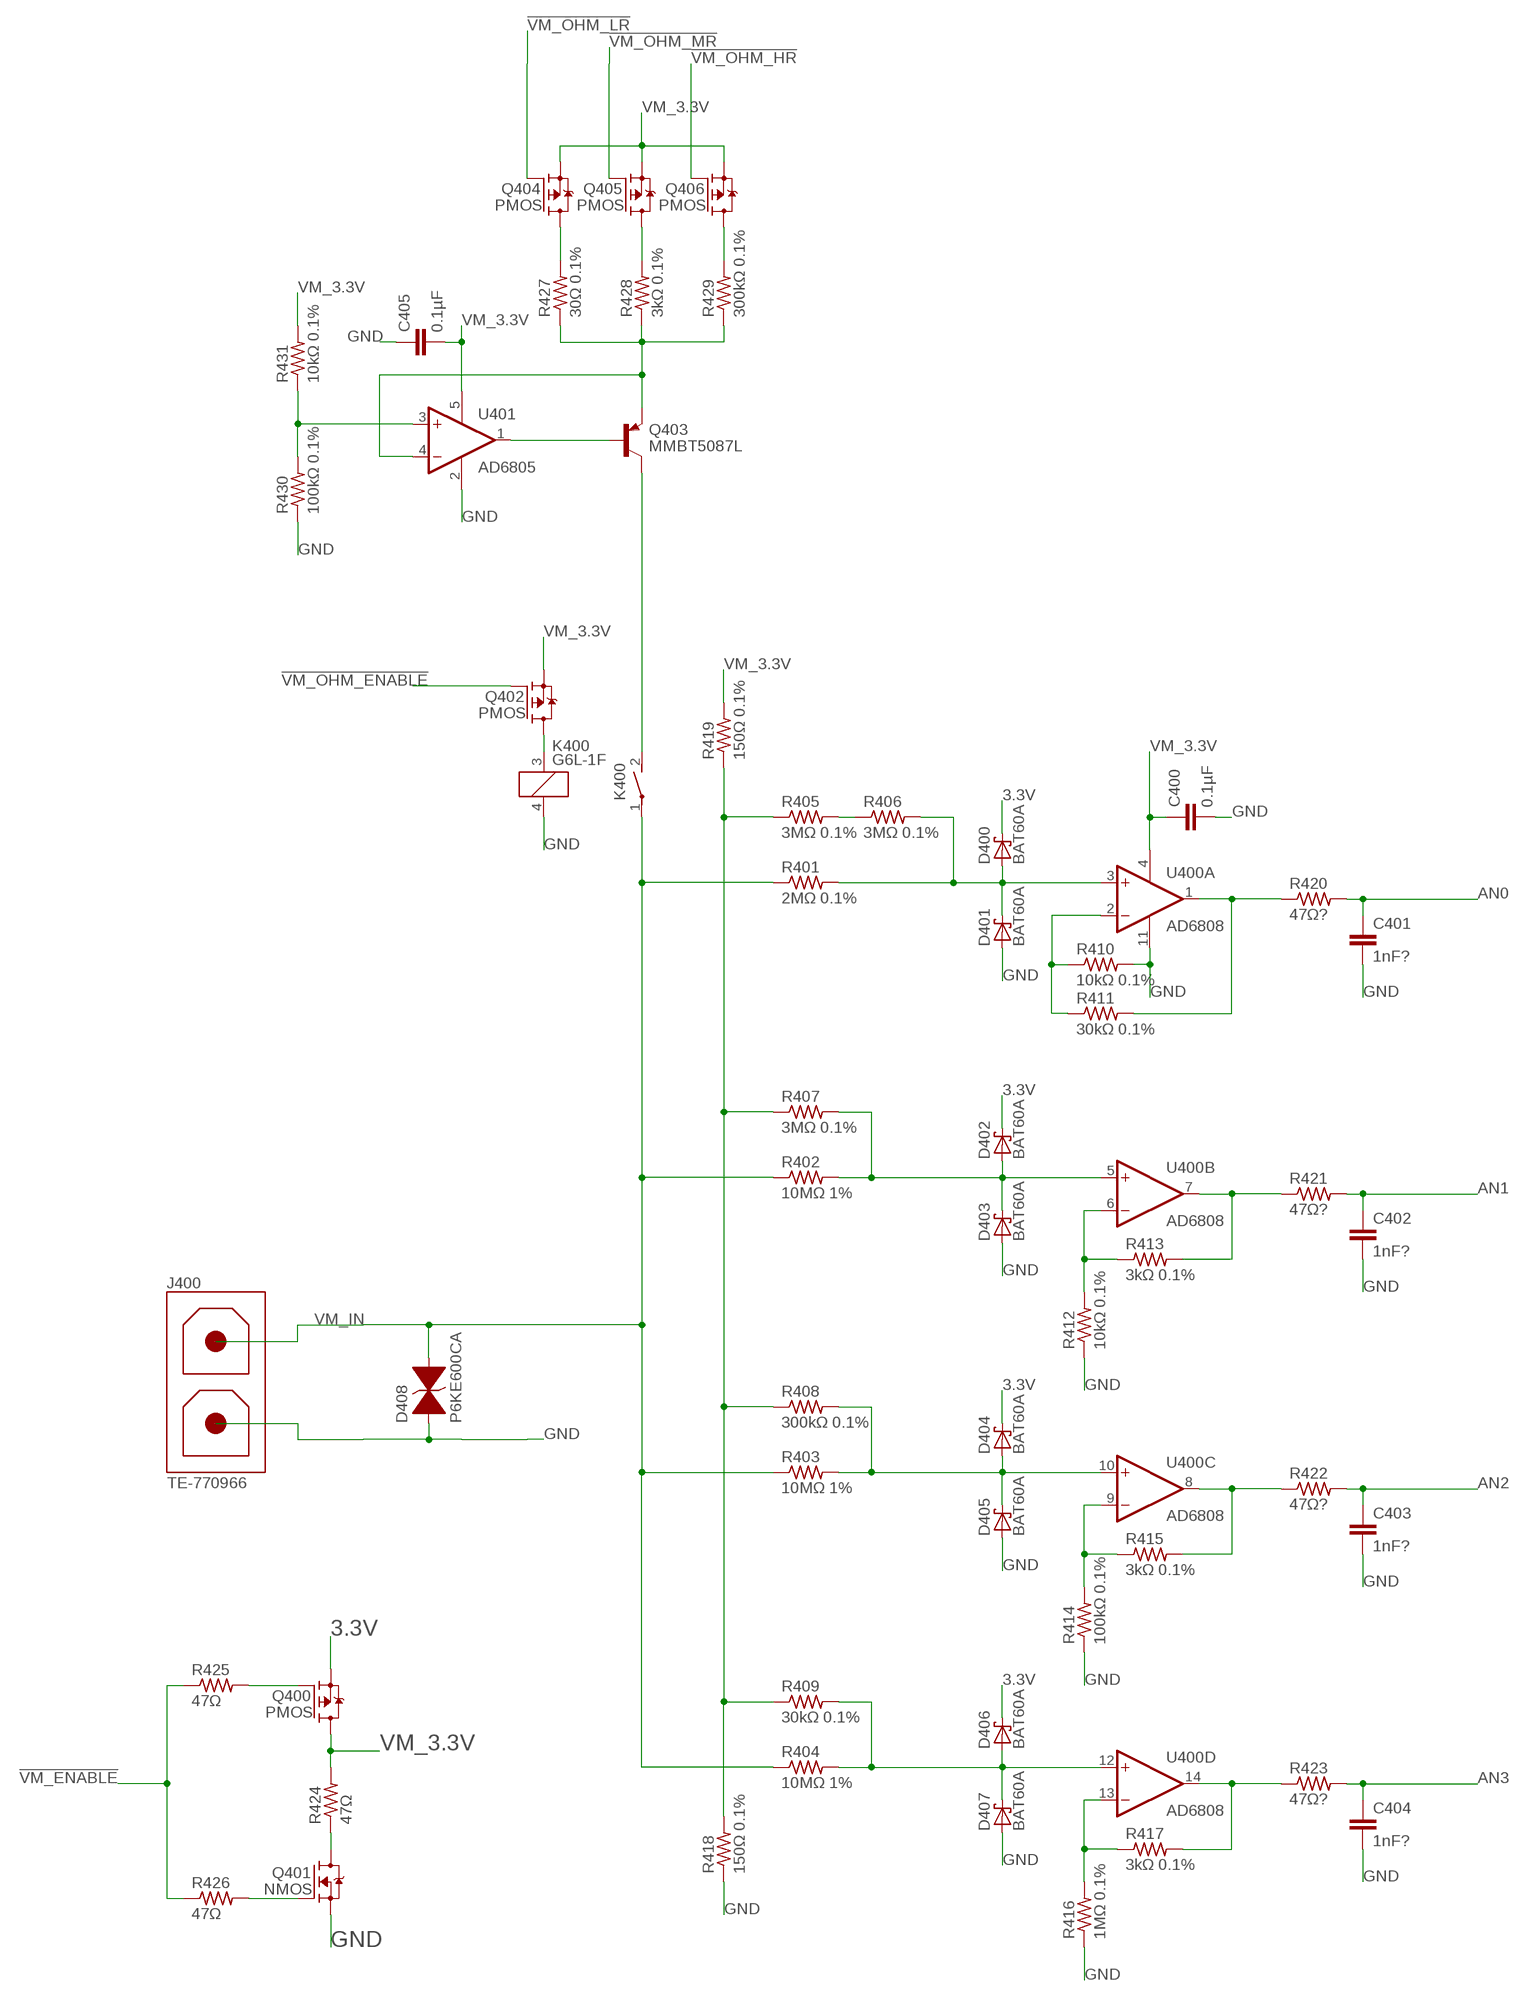
[diagram p5: schematic, sheet 4]

### Parts
C400  0.1µF  C-EUC0805K  [C0805K]
C401  1nF?  C-EUC0805K  [C0805K]
C402  1nF?  C-EUC0805K  [C0805K]
C403  1nF?  C-EUC0805K  [C0805K]
C404  1nF?  C-EUC0805K  [C0805K]
C405  0.1µF  C-EUC0805K  [C0805K]
D400  BAT60A  SOD323-SCHOTTKY  [SOD323]
D401  BAT60A  SOD323-SCHOTTKY  [SOD323]
D402  BAT60A  SOD323-SCHOTTKY  [SOD323]
D403  BAT60A  SOD323-SCHOTTKY  [SOD323]
D404  BAT60A  SOD323-SCHOTTKY  [SOD323]
D405  BAT60A  SOD323-SCHOTTKY  [SOD323]
D406  BAT60A  SOD323-SCHOTTKY  [SOD323]
D407  BAT60A  SOD323-SCHOTTKY  [SOD323]
D408  P6KE600CA  P6KE-CA  [DO-204AC]
J400  TE-770966  [TE-770966]
K400  G6L-1F  [G6L-1F]
Q400  PMOS  SOT23-P-MOSFET  [SOT23]
Q401  NMOS  SOT23-N-MOSFET  [SOT23]
Q402  PMOS  SOT23-P-MOSFET  [SOT23]
Q403  MMBT5087L  SOT23-PNP  [SOT23]
Q404  PMOS  SOT23-P-MOSFET  [SOT23]
Q405  PMOS  SOT23-P-MOSFET  [SOT23]
Q406  PMOS  SOT23-P-MOSFET  [SOT23]
R401  2MΩ 0.1%  R-US_R1206  [R1206]
R402  10MΩ 1%  R-US_R1206  [R1206]
R403  10MΩ 1%  R-US_R1206  [R1206]
R404  10MΩ 1%  R-US_R1206  [R1206]
R405  3MΩ 0.1%  R-US_R0805  [R0805]
R406  3MΩ 0.1%  R-US_R0805  [R0805]
R407  3MΩ 0.1%  R-US_R0805  [R0805]
R408  300kΩ 0.1%  R-US_R0805  [R0805]
R409  30kΩ 0.1%  R-US_R0805  [R0805]
R410  10kΩ 0.1%  R-US_R0805  [R0805]
R411  30kΩ 0.1%  R-US_R0805  [R0805]
R412  10kΩ 0.1%  R-US_R0805  [R0805]
R413  3kΩ 0.1%  R-US_R0805  [R0805]
R414  100kΩ 0.1%  R-US_R0805  [R0805]
R415  3kΩ 0.1%  R-US_R0805  [R0805]
R416  1MΩ 0.1%  R-US_R0805  [R0805]
R417  3kΩ 0.1%  R-US_R0805  [R0805]
R418  150Ω 0.1%  R-US_R0805  [R0805]
R419  150Ω 0.1%  R-US_R0805  [R0805]
R420  47Ω?  R-US_R0805  [R0805]
R421  47Ω?  R-US_R0805  [R0805]
R422  47Ω?  R-US_R0805  [R0805]
R423  47Ω?  R-US_R0805  [R0805]
R424  47Ω  R-US_R0805  [R0805]
R425  47Ω  R-US_R0805  [R0805]
R426  47Ω  R-US_R0805  [R0805]
R427  30Ω 0.1%  R-US_R0805  [R0805]
R428  3kΩ 0.1%  R-US_R0805  [R0805]
R429  300kΩ 0.1%  R-US_R0805  [R0805]
R430  100kΩ 0.1%  R-US_R0805  [R0805]
R431  10kΩ 0.1%  R-US_R0805  [R0805]
U400  AD6808  [SO14]
U401  AD6805  [SOT23-5L]

### Nets
3.3V: D400.1(C) D402.1(C) D404.1(C) D406.1(C) Q400.2(S) ; also sheet 1,2,3,5
!VM_ENABLE: R425.1 R426.1 ; also sheet 1
!VM_OHM_ENABLE: Q402.1(G) ; also sheet 1
!VM_OHM_HR: Q406.1(G) ; also sheet 1
!VM_OHM_LR: Q404.1(G) ; also sheet 1
!VM_OHM_MR: Q405.1(G) ; also sheet 1
AN0: C401.1 R420.2 ; also sheet 1
AN1: C402.1 R421.2 ; also sheet 1
AN2: C403.1 R422.2 ; also sheet 1
AN3: C404.1 R423.2 ; also sheet 1
GND: C400.2 C401.2 C402.2 C403.2 C404.2 C405.1 D401.2(A) D403.2(A) D405.2(A) D407.2(A) D408.1 J400.1 K400.4 Q401.2(S) R410.2 R412.1 R414.1 R416.1 R418.1 R430.1 U400.11(A:V-) U401.2(V-) ; also sheet 1,2,5
VM_0.5_IN: D400.2(A) D401.1(C) R401.2 R406.2 U400.3(A:+IN)
VM_0.5_OUT: R411.2 R420.1 U400.1(A:OUT)
VM_0.5_R: R405.2 R406.1
VM_0.5_RE: R410.1 R411.1 U400.2(A:-IN)
VM_1.65V: R405.1 R407.1 R408.1 R409.1 R418.2 R419.1
VM_3.3V: C400.1 C405.2 Q400.3(D) Q402.2(S) Q404.2(S) Q405.2(S) Q406.2(S) R419.2 R424.2 R431.2 U400.4(A:V+) U401.5(V+)
VM_3.3V_SHP: Q401.3(D) R424.1
VM_5_IN: D402.2(A) D403.1(C) R402.2 R407.2 U400.5(B:+IN)
VM_5_OUT: R413.2 R421.1 U400.7(B:OUT)
VM_5_RE: R412.2 R413.1 U400.6(B:-IN)
VM_50_IN: D404.2(A) D405.1(C) R403.2 R408.2 U400.10(C:+IN)
VM_50_OUT: R415.2 R422.1 U400.8(C:OUT)
VM_50_RE: R414.2 R415.1 U400.9(C:-IN)
VM_500_IN: D406.2(A) D407.1(C) R404.2 R409.2 U400.12(D:+IN)
VM_500_OUT: R417.2 R423.1 U400.14(D:OUT)
VM_500_RE: R416.2 R417.1 U400.13(D:-IN)
VM_IN: D408.2 J400.2 K400.1(S:P) R401.1 R402.1 R403.1 R404.1
VM_NMOS_GATE: Q401.1(G) R426.2
VM_OHM_1U: Q406.3(D) R429.2
VM_OHM_10M: Q404.3(D) R427.2
VM_OHM_100U: Q405.3(D) R428.2
VM_OHM_COIL: K400.3 Q402.3(D)
VM_OHM_CTRL: Q403.1(B) U401.1(OUT)
VM_OHM_ICT: Q403.2(E) R427.1 R428.1 R429.1 U401.4(-IN)
VM_OHM_IOUT: K400.2(S:S) Q403.3(C)
VM_OHM_VREF: R430.2 R431.1 U401.3(+IN)
VM_PMOS_GATE: Q400.1(G) R425.2

## Sheet 5 of 5
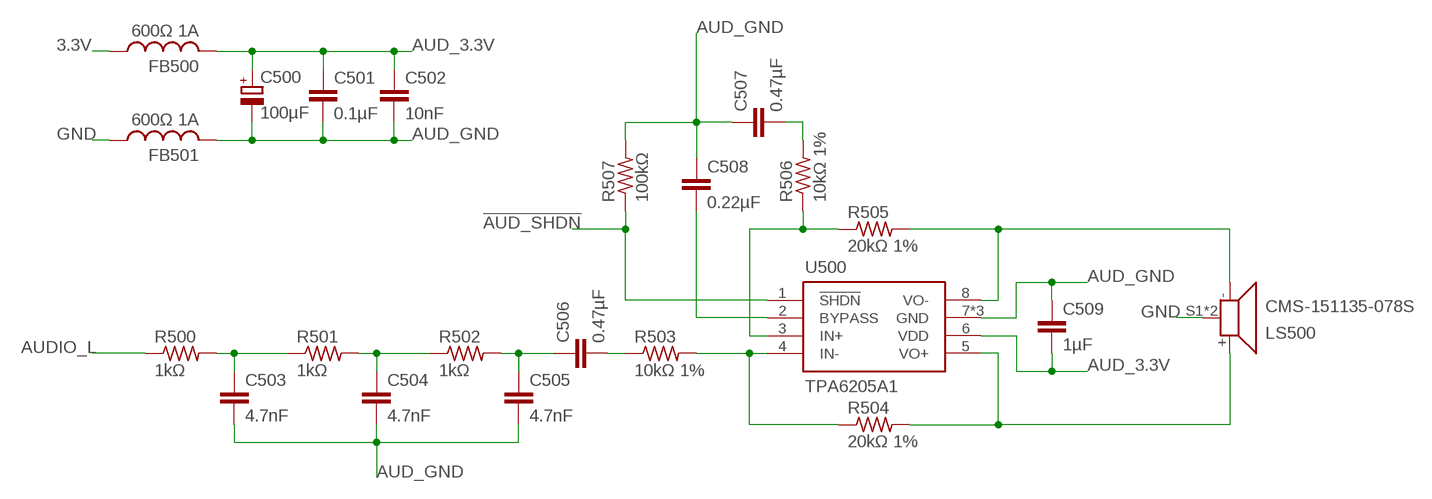
[diagram p6: schematic, sheet 5]

### Parts
C500  100µF  CPOL_1206  [C1206K-POL]
C501  0.1µF  C-EUC0805K  [C0805K]
C502  10nF  C-EUC0805K  [C0805K]
C503  4.7nF  C-EUC0805K  [C0805K]
C504  4.7nF  C-EUC0805K  [C0805K]
C505  4.7nF  C-EUC0805K  [C0805K]
C506  0.47µF  C-EUC0805K  [C0805K]
C507  0.47µF  C-EUC0805K  [C0805K]
C508  0.22µF  C-EUC0805K  [C0805K]
C509  1µF  C-EUC0805K  [C0805K]
FB500  600Ω 1A  0805-FERRITE  [C0805K]
FB501  600Ω 1A  0805-FERRITE  [C0805K]
LS500  CMS-151135-078S  [CMS-151135-078S]
R500  1kΩ  R-US_R0805  [R0805]
R501  1kΩ  R-US_R0805  [R0805]
R502  1kΩ  R-US_R0805  [R0805]
R503  10kΩ 1%  R-US_R0805  [R0805]
R504  20kΩ 1%  R-US_R0805  [R0805]
R505  20kΩ 1%  R-US_R0805  [R0805]
R506  10kΩ 1%  R-US_R0805  [R0805]
R507  100kΩ  R-US_R0805  [R0805]
U500  TPA6205A1  [MSOP8-TP]

### Nets
3.3V: FB500.1 ; also sheet 1,2,3,4
!AUD_SHDN: R507.1 U500.1(!SHDN) ; also sheet 1
AUD_3.3V: C500.1(+) C501.1 C502.1 C509.2 FB500.2 U500.6(VDD)
AUD_AMP_BYPASS: C508.2 U500.2(BYPASS)
AUD_AMP_IN+: R505.1 R506.1 U500.3(IN+)
AUD_AMP_IN+_FILTER: C507.2 R506.2
AUD_AMP_IN-: R503.2 R504.1 U500.4(IN-)
AUD_AMP_VO+: LS500.+ R504.2 U500.5(VO+)
AUD_AMP_VO-: LS500.- R505.2 U500.8(VO-)
AUD_FILTER_S1: C503.1 R500.2 R501.1
AUD_FILTER_S2: C504.1 R501.2 R502.1
AUD_FILTER_S3: C505.1 C506.1 R502.2
AUD_FILTER_S4: C506.2 R503.1
AUD_GND: C500.2(-) C501.2 C502.2 C503.2 C504.2 C505.2 C507.1 C508.1 C509.1 FB501.2 R507.2 U500.7(GND) U500.TP1(GND) U500.TP2(GND)
AUDIO_L: R500.1 ; also sheet 1
GND: FB501.1 LS500.S1 LS500.S2 ; also sheet 1,2,4

## Library data of the parts
BT200 = ExtraParts:KEYSTONE-1048
C100-C127 C201-C205 C400-C405 C501-C509 = rcl:C-EU: CAPACITOR, European symbol; SPICEPREFIX: C
C200 C500 = ExtraParts:CPOL_1206
D200-D205 D300-D305 D400-D407 = ExtraParts:SOD323-SCHOTTKY
D408 = ExtraParts:P6KE-CA
F100 = ExtraParts:1206-FUSE
F200 = ExtraParts:0805-FUSE
FB500 FB501 = ExtraParts:0805-FERRITE
J100 = ExtraParts:PINHD-1X8
J101 J102 = ExtraParts:90152-16
J200 = ExtraParts:ZX62D-B-5PA8
J400 = ExtraParts:TE-770966
K400 = ExtraParts:G6L-1F
LED100 = led:LED: LED OSRAM: - CHIPLED LG R971, LG N971, LY N971, LG Q971, LY Q971, LO R971, LY R971 LH N974, LH R974 LS Q976, LO Q976, LY Q976 LO Q996 - Hyper CHIPLED LW Q18S LB Q993, LB Q99A, LB R99A - SideLED LS A670, LO A670, LY A670, LG A670, LP A670 LB A673, LV A673, LT A673, LW A673 LH A674 LY A675 LS A676, LA A676, LO A676, LY A676, LW A676 LS A679, LY A679, LG A679 - Hyper Micro SIDELED® LS Y876, LA Y876, LO Y876, LY Y876 LT Y87S - SmartLED LW L88C, LW L88S LB L89C, LB L89S, LG L890 LS L89K, LO L89K, LY L89K LS L896, LA L896, LO L896, LY L896 - TOPLED LS T670, LO T670, LY T670, LG T670, LP T670 LSG T670, LSP T670, LSY T670, LOP T670, LYG T670 LG T671, LOG T671, LSG T671 LB T673, LV T673, LT T673, LW T673 LH T674 LS T676, LA T676, LO T676, LY T676, LB T676, LH T676, LSB T676, LW T676 LB T67C, LV T67C, LT T67C, LS T67K, LO T67K, LY T67K, LW E67C LS E67B, LA E67B, LO E67B, LY E67B, LB E67C, LV E67C, LT E67C LW T67C LS T679, LY T679, LG T679 LS T770, LO T770, LY T770, LG T770, LP T770 LB T773, LV T773, LT T773, LW T773 LH T774 LS E675, LA E675, LY E675, LS T675 LS T776, LA T776, LO T776, LY T776, LB T776 LHGB T686 LT T68C, LB T68C - Hyper Mini TOPLED® LB M676 - Mini TOPLED Santana® LG M470 LS M47K, LO M47K, LY M47K Source: http://www.osram.convergy.de LUXEON: - LUMILED® LXK2-PW12-R00, LXK2-PW12-S00, LXK2-PW14-U00, LXK2-PW14-V00 LXK2-PM12-R00, LXK2-PM12-S00, LXK2-PM14-U00 LXK2-PE12-Q00, LXK2-PE12-R00, LXK2-PE12-S00, LXK2-PE14-T00, LXK2-PE14-U00 LXK2-PB12-K00, LXK2-PB12-L00, LXK2-PB12-M00, LXK2-PB14-N00, LXK2-PB14-P00, LXK2-PB14-Q00 LXK2-PR12-L00, LXK2-PR12-M00, LXK2-PR14-Q00, LXK2-PR14-R00 LXK2-PD12-Q00, LXK2-PD12-R00, LXK2-PD12-S00 LXK2-PH12-R00, LXK2-PH12-S00 LXK2-PL12-P00, LXK2-PL12-Q00, LXK2-PL12-R00 Source: www.luxeon.com KINGBRIGHT: KA-3528ASYC Source: www.kingbright.com
LED200 = ExtraParts:APHBM2012LSURKZGKC
LS500 = ExtraParts:CMS-151135-078S
Q100 Q102 Q103 Q203 Q401 = ExtraParts:SOT23-N-MOSFET
Q101 Q200-Q202 Q400 Q402 Q404-Q406 = ExtraParts:SOT23-P-MOSFET
Q403 = ExtraParts:SOT23-PNP
R100-R119 R200-R213 R405-R431 R500-R507 = resistor:R-US_: RESISTOR, American symbol
R401-R404 = rcl:R-US_: RESISTOR, American symbol; SPICEPREFIX: R
S100 S300-S349 = ExtraParts:TL3305
SJ100-SJ102 SJ105 SJ106 = jumper:SJ2W: SMD solder JUMPER
SJ103 SJ104 = jumper:SJ: SMD solder JUMPER
U100 = ExtraParts:PIC32MZ-144; SPICEPREFIX: X
U101 = ExtraParts:IS62WV10248EBLL
U102 = ExtraParts:DS32KHZ
U103 = ExtraParts:MAX6816
U104 = ExtraParts:TLC555-D
U105 = ExtraParts:VEML7700
U106 = ExtraParts:HDC2080
U107 = ExtraParts:DAC8552
U200 = ExtraParts:TLV757P
U201 = ExtraParts:MCP73831
U202 = ExtraParts:MAX6776X
U203 U401 = ExtraParts:AD6805
U400 = ExtraParts:AD6808
U500 = ExtraParts:TPA6205A1
XDS100 = ExtraParts:NHD-3.5-320240FT
XU100 = ExtraParts:11400841
Y100 = ExtraParts:HC49US-CRYSTAL
Y101 = ExtraParts:CMJ206T
Z200 = ExtraParts:SOD323HE-ZENER

## Net classes
1 usb_diffpair: width 0.152 mm, clearance 0.127 mm